# Altium schematic sheet MCU.SchDoc
size A3; Organization: Altium Limited; Address1: L3, 12a Rodborough Rd; Address2: Frenchs Forest; Address3: NSW; Address4: Australia 2086
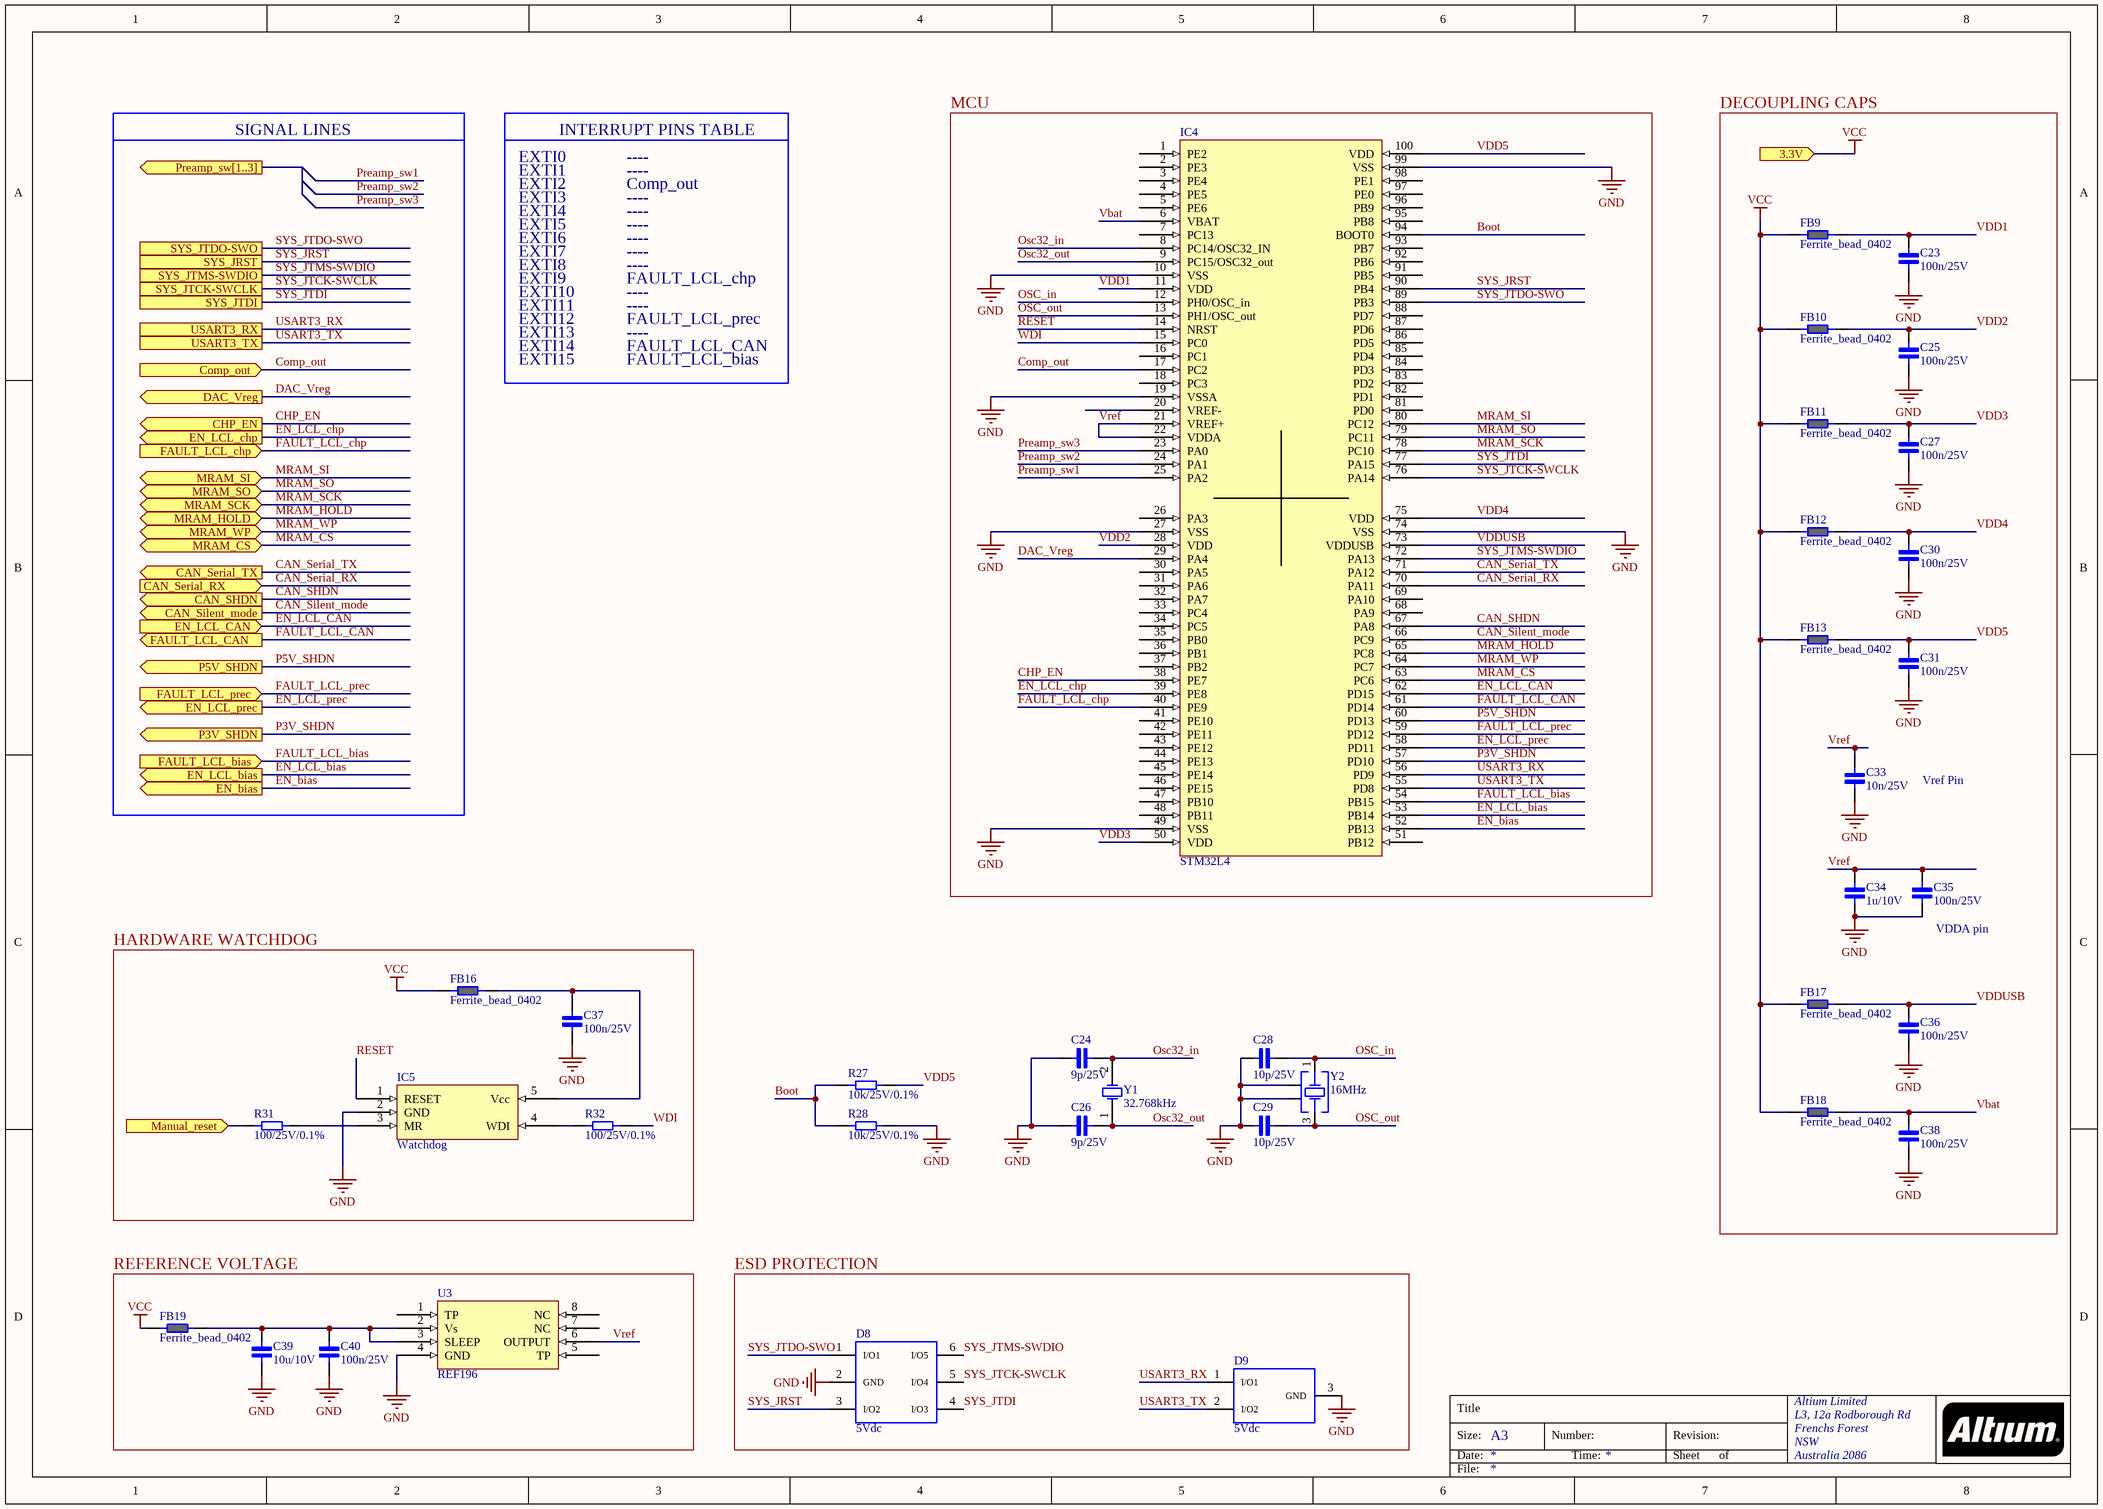
[diagram p0: MCU.SchDoc]

## Parts
C23  100n/25V  [Cap_0402]
C24  9p/25V  [Cap_0402]
C25  100n/25V  [Cap_0402]
C26  9p/25V  [Cap_0402]
C27  100n/25V  [Cap_0402]
C28  10p/25V  [Cap_0402]
C29  10p/25V  [Cap_0402]
C30  100n/25V  [Cap_0402]
C31  100n/25V  [Cap_0402]
C33  10n/25V  [Cap_0402]
C34  1u/10V  [Cap_0402]
C35  100n/25V  [Cap_0402]
C36  100n/25V  [Cap_0402]
C37  100n/25V  [Cap_0402]
C38  100n/25V  [Cap_0402]
C39  10u/10V  [CAP_0603]
C40  100n/25V  [Cap_0402]
D8  5Vdc  [WE-TVS_SOT23-6L]
D9  5Vdc  [WE-TVS_SOT23-3L]
FB9  Ferrite_bead_0402  [FERRITE_0402]
FB10  Ferrite_bead_0402  [FERRITE_0402]
FB11  Ferrite_bead_0402  [FERRITE_0402]
FB12  Ferrite_bead_0402  [FERRITE_0402]
FB13  Ferrite_bead_0402  [FERRITE_0402]
FB16  Ferrite_bead_0402  [FERRITE_0402]
FB17  Ferrite_bead_0402  [FERRITE_0402]
FB18  Ferrite_bead_0402  [FERRITE_0402]
FB19  Ferrite_bead_0402  [FERRITE_0402]
IC4  STM32L4  [LQFP100]
IC5  Watchdog  [SOT-23-5]
R27  10k/25V/0.1%  [RES_0402]
R28  10k/25V/0.1%  [RES_0402]
R31  100/25V/0.1%  [RES_0402]
R32  100/25V/0.1%  [RES_0402]
U3  REF196  [SOIC8]
Y1  32.768kHz  [WE-XTAL_IQXC-25]
Y2  16MHz  [WE-XTAL_CFPX-218]

## Blocks framed on the sheet
MCU: IC4
DECOUPLING CAPS: C23 C25 C27 C30 C31 C33-C36 C38 FB9-FB13 FB17 FB18
HARDWARE WATCHDOG: C37 FB16 IC5 R31 R32
REFERENCE VOLTAGE: C39 C40 FB19 U3
ESD PROTECTION: D8 D9

## Ports
3.3V (in), CAN_Serial_RX (in), CAN_Serial_TX (out), CAN_SHDN (out), CAN_Silent_mode (out), CHP_EN (out), Comp_out (in), DAC_Vreg (out), EN_bias (out), EN_LCL_bias (out), EN_LCL_CAN (in), EN_LCL_chp (out), EN_LCL_prec (out), FAULT_LCL_bias (in), FAULT_LCL_CAN (out), FAULT_LCL_chp (in), FAULT_LCL_prec (in), Manual_reset (in), MRAM_CS (bidir), MRAM_HOLD (bidir), MRAM_SCK (bidir), MRAM_SI (bidir), MRAM_SO (bidir), MRAM_WP (bidir), P3V_SHDN (out), P5V_SHDN (out), Preamp_sw[1..3] (out), SYS_JRST, SYS_JTCK-SWCLK, SYS_JTDI, SYS_JTDO-SWO, SYS_JTMS-SWDIO, USART3_RX, USART3_TX

## Nets
GND: C23.1 C24.1 C25.1 C26.1 C27.1 C28.1 C29.1 C30.1 C31.1 C33.1 C34.1 C35.1 C36.1 C37.1 C38.1 C39.1 C40.1 D8.2(GND) D9.3(GND) IC4.10(VSS) IC4.19(VSSA) IC4.27(VSS) IC4.49(VSS) IC4.74(VSS) IC4.99(VSS) IC5.2(GND) R28.2 U3.4(GND) Y2.2(GND) Y2.4(GND)
VCC: FB9.1 FB10.1 FB11.1 FB12.1 FB13.1 FB16.1 FB17.1 FB18.1 FB19.1 ; port 3.3V
Boot: IC4.94(BOOT0) R27.1 R28.1
CAN_Serial_RX: IC4.70(PA11) ; port CAN_Serial_RX
CAN_Serial_TX: IC4.71(PA12) ; port CAN_Serial_TX
CAN_SHDN: IC4.67(PA8) ; port CAN_SHDN
CAN_Silent_mode: IC4.66(PC9) ; port CAN_Silent_mode
CHP_EN: IC4.38(PE7) ; port CHP_EN
Comp_out: IC4.17(PC2) ; port Comp_out
DAC_Vreg: IC4.29(PA4) ; port DAC_Vreg
EN_bias: IC4.52(PB13) ; port EN_bias
EN_LCL_bias: IC4.53(PB14) ; port EN_LCL_bias
EN_LCL_CAN: IC4.62(PD15) ; port EN_LCL_CAN
EN_LCL_chp: IC4.39(PE8) ; port EN_LCL_chp
EN_LCL_prec: IC4.58(PD11) ; port EN_LCL_prec
FAULT_LCL_bias: IC4.54(PB15) ; port FAULT_LCL_bias
FAULT_LCL_CAN: IC4.61(PD14) ; port FAULT_LCL_CAN
FAULT_LCL_chp: IC4.40(PE9) ; port FAULT_LCL_chp
FAULT_LCL_prec: IC4.59(PD12) ; port FAULT_LCL_prec
Manual_reset: R31.1 ; port Manual_reset
MRAM_CS: IC4.63(PC6) ; port MRAM_CS
MRAM_HOLD: IC4.65(PC8) ; port MRAM_HOLD
MRAM_SCK: IC4.78(PC10) ; port MRAM_SCK
MRAM_SI: IC4.80(PC12) ; port MRAM_SI
MRAM_SO: IC4.79(PC11) ; port MRAM_SO
MRAM_WP: IC4.64(PC7) ; port MRAM_WP
Osc32_in: C24.2 IC4.8(PC14/OSC32_IN) Y1.2(OSC2)
Osc32_out: C26.2 IC4.9(PC15/OSC32_out) Y1.1(OSC1)
OSC_in: C28.2 IC4.12(PH0/OSC_in) Y2.1(Crystal)
OSC_out: C29.2 IC4.13(PH1/OSC_out) Y2.3(Crystal)
P3V_SHDN: IC4.57(PD10) ; port P3V_SHDN
P5V_SHDN: IC4.60(PD13) ; port P5V_SHDN
Preamp_sw1: IC4.25(PA2)
Preamp_sw2: IC4.24(PA1)
Preamp_sw3: IC4.23(PA0)
RESET: IC4.14(NRST) IC5.1(RESET)
SYS_JRST: D8.3(I/O2) IC4.90(PB4) ; port SYS_JRST
SYS_JTCK-SWCLK: D8.5(I/O4) IC4.76(PA14) ; port SYS_JTCK-SWCLK
SYS_JTDI: D8.4(I/O3) IC4.77(PA15) ; port SYS_JTDI
SYS_JTDO-SWO: D8.1(I/O1) IC4.89(PB3) ; port SYS_JTDO-SWO
SYS_JTMS-SWDIO: D8.6(I/O5) IC4.72(PA13) ; port SYS_JTMS-SWDIO
USART3_RX: D9.1(I/O1) IC4.56(PD9) ; port USART3_RX
USART3_TX: D9.2(I/O2) IC4.55(PD8) ; port USART3_TX
Vbat: C38.2 FB18.2 IC4.6(VBAT)
VDD1: C23.2 FB9.2 IC4.11(VDD)
VDD2: C25.2 FB10.2 IC4.28(VDD)
VDD3: C27.2 FB11.2 IC4.50(VDD)
VDD4: C30.2 FB12.2 IC4.75(VDD)
VDD5: C31.2 FB13.2 IC4.100(VDD) R27.2
VDDUSB: C36.2 FB17.2 IC4.73(VDDUSB)
Vref: C33.2 C34.2 C35.2 IC4.21(VREF+) IC4.22(VDDA) U3.6(OUTPUT)
WDI: IC4.15(PC0) R32.2
NetC37_2: C37.2 FB16.2 IC5.5(Vcc)
NetC39_2: C39.2 C40.2 FB19.2 U3.2(Vs) U3.3(SLEEP)
NetIC5_3: IC5.3(MR) R31.2
NetIC5_4: IC5.4(WDI) R32.1

Not connected (* = marked no-connect by the designer): IC4 1(PE2) 2(PE3) 3(PE4) 4(PE5) 5(PE6) 7(PC13) 16(PC1) 18(PC3) 20(VREF-) 26(PA3) 30(PA5) 31(PA6) 32(PA7) 33(PC4) 34(PC5) 35(PB0) 36(PB1) 37(PB2) 41(PE10) 42(PE11) 43(PE12) 44(PE13) 45(PE14) 46(PE15) 47(PB10) 48(PB11) 51(PB12) 68(PA9) 69(PA10) 81(PD0) 82(PD1) 83(PD2) 84(PD3) 85(PD4) 86(PD5) 87(PD6) 88(PD7) 91(PB5) 92(PB6) 93(PB7) 95(PB8) 96(PB9) 97(PE0) 98(PE1); U3 1(TP) 5(TP) 7(NC) 8(NC)

## Notes on the sheet
- SIGNAL LINES
- EXTI0
- EXTI1
- INTERRUPT PINS TABLE
- ----
- EXTI2
- EXTI3
- EXTI4
- EXTI5
- EXTI6
- Comp_out
- EXTI7
- EXTI8
- EXTI9
- EXTI10
- EXTI11
- FAULT_LCL_chp
- EXTI12
- EXTI13
- EXTI14
- EXTI15
- FAULT_LCL_prec
- FAULT_LCL_CAN
- FAULT_LCL_bias
- Vref Pin
- (near C35) VDDA pin
- Title
- Size:
- Date:
- A3
- Number:
- Time:
- Revision:
- Sheet
- of
- File:

## Library data of the parts
C23 C25 C27 C30 C31 C35-C38 C40 = Cap_0402_100n: Ceramic Capacitor 100n / 0402 / 25V / ±5%, Wurth Elektronik MLCC; ComponentLink1Description: New link; ComponentLink1URL: https://www.we-online.com/catalog/en/WCAP-CSGP-25VDC
C24 C26 = Cap_0402_9p: 0402 / 25V / ±5%, Wurth Elektronik MLCC; ComponentLink1Description: New link; ComponentLink1URL: https://www.we-online.com/catalog/en/WCAP-CSGP-25VDC
C28 C29 = Cap_0402_10p: 0402 / 25V / ±5%, Wurth Elektronik MLCC; ComponentLink1Description: New link; ComponentLink1URL: https://www.we-online.com/catalog/en/WCAP-CSGP-25VDC
C33 = Cap_0402_10n: Ceramic Capacitor 10n / 0402 / 25V / ±5%, Wurth Elektronik MLCC; ComponentLink1Description: New link; ComponentLink1URL: https://www.we-online.com/catalog/en/WCAP-CSGP-25VDC
C34 = Cap_0402_1u: Ceramic Capacitor 1uF / 0402 / 10V / ±5%, Wurth Elektronik MLCC
C39 = Cap_0603_10u: Ceramic Capacitor 10uF / 0603 / 10V / ±5%, Wurth Elektronik MLCC
D8 = 82402305: WE-TVS TVS Diode - Standard Series, SOT23-6L, 5Channel, 5Vdc; Manufacturer: Wurth Elektronik; Reverse Breakdown Voltage min.: 6V; Channel: 5; Channel Input Capacitance: 13pF; Reverse Peak Pulse Current: 6A; Reverse Channel Leakage Current: 2.5uA; DC Operating Voltage: 5V; ComponentLink1Description: Manufacturer; ComponentLink1URL: http://www.we-online.de; ComponentLink2Description: Datasheet; ComponentLink2URL: https://www.we-online.com/catalog/datasheet/82402305.pdf; Manufacturer Part Number: 82402305; Published Date: April 2020; Size: SOT23-6L; Operating Temperature: -55 to +85degC; Mounting Technology: SMT; Packaging: Tape and Reel
D9 = 824021: WE-TVS TVS Diode - Standard Series, SOT23-3L, 2Channel, 5Vdc; Manufacturer: Wurth Elektronik; Reverse Breakdown Voltage min.: 6.1V; Channel: 2; Channel Input Capacitance: 55pF; Reverse Peak Pulse Current: 15A; Reverse Channel Leakage Current: 2.5uA; DC Operating Voltage: 5V; ComponentLink1Description: Manufacturer; ComponentLink1URL: http://www.we-online.de; ComponentLink2Description: Datasheet; ComponentLink2URL: https://www.we-online.com/catalog/datasheet/824021.pdf; Manufacturer Part Number: 824021; Published Date: April 2020; Size: SOT23-3L; Operating Temperature: -55 to +125degC; Mounting Technology: SMT; Packaging: Tape and Reel
FB9-FB13 FB16-FB19 = Ferrite_bead_0402: Ferrite bead, wurth 74269241102
IC4 = STM32L476VGT6: Microcontroller STM32; ComponentLink1Description: New link; ComponentLink1URL: https://www.digchip.com/datasheets/parts/datasheet/456/STM32L476-pdf.php
IC5 = MAX823: Watchdog, 5-Pin Microprocessor Supervisory Circuits With / Watchdog Timer and Manual Reset; ComponentLink1Description: New link; ComponentLink1URL: https://pl.mouser.com/datasheet/2/256/MAX823-MAX825Z-1116133.pdf
R27 R28 = Res_0402_10k: Vishay, thin film resistor 10k/25V/0.1%
R31 R32 = Res_0402_100: Vishay, thin film resistor 100/25V/0.1%
U3 = REF196: Precision Micropower, / Low Dropout Voltage References; ComponentLink1Description: New link; ComponentLink1URL: https://www.analog.com/media/en/technical-documentation/data-sheets/REF19xSeries.pdf
Y1 = 830062558: WE-XTAL Watch Crystal, SMT, IQXC-25, 32.768kHz, +/-10ppm; Manufacturer: Wurth Elektronik; Load Capacitance: 9pF; ComponentLink1Description: Manufacturer; ComponentLink1URL: http://www.we-online.de; ComponentLink2Description: Datasheet; ComponentLink2URL: https://katalog.we-online.com/pbs/datasheet/830062558.pdf; Operating Temperature: -40 to +85degC; Packaging: Tape and Reel; Manufacturer Part Number: 830062558; Published Date: July 2020; Size: IQXC-25; Frequency Stability: -; Frequency: 32.768kHz; Frequency Tolerance: +/-10ppm; Mounting Technology: SMT
Y2 = 830069392: WE-XTAL Quartz Crystal, SMT, CFPX-218, 16MHz, +/-20ppm; Manufacturer: Wurth Elektronik; Load Capacitance: 10pF; ComponentLink1Description: Manufacturer; ComponentLink1URL: http://www.we-online.de; ComponentLink2Description: Datasheet; ComponentLink2URL: https://katalog.we-online.com/pbs/datasheet/830069392.pdf; Operating Temperature: -40 to +85degC; Packaging: Tape and Reel; Manufacturer Part Number: 830069392; Published Date: July 2020; Size: CFPX-218; Frequency Stability: +/-20ppm; Frequency: 16MHz; Frequency Tolerance: +/-20ppm; Mounting Technology: SMT